# EAGLE design NRF24L01 TestbedV1 (EAGLE 6.5.0)
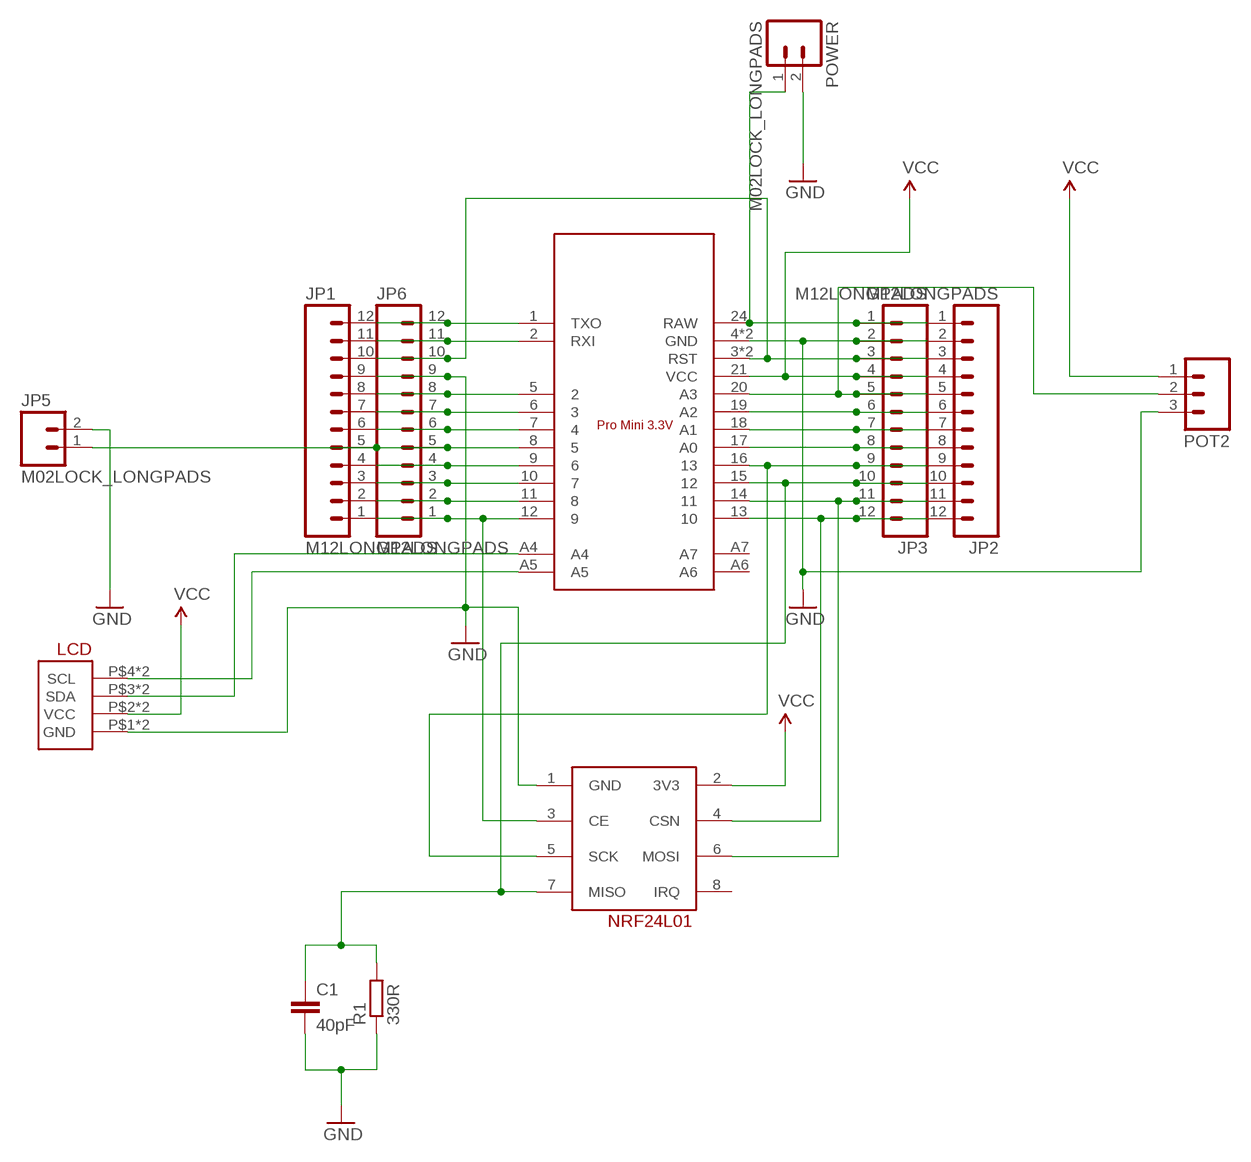
[diagram p0: schematic, sheet 1]

## Parts
C1  40pF  C-EUC1206  [C1206]
JP1  M12LONGPADS  [1X12_LONGPADS]
JP2  M12LONGPADS  [1X12_LONGPADS]
JP3  M12LONGPADS  [1X12_LONGPADS]
JP5  M02LOCK_LONGPADS  [1X02_LOCK_LONGPADS]
JP6  M12LONGPADS  [1X12_LONGPADS]
POT2  M03LONGPADS  [1X03_LONGPADS]
POWER  M02LOCK_LONGPADS  [1X02_LOCK_LONGPADS]
R1  330R  R-EU_R1206  [R1206]
U$1  ARDUINO_PRO_MINI_3V3  [ARDUINO_PRO_MINI_3V3]
U$2  NRF24L01BOARD  [NRF24L01BOARD]
U$3  I2C-LCD  [I2C-LCD]

## Nets
GND: C1.2 JP1.9 JP2.2 JP3.2 JP5.2 JP6.9 POT2.3 POWER.2 R1.1 U$1.4(GND) U$1.23(GND) U$2.1(GND) U$3.P$1(GND) U$3.S$1(GND)
N$1: JP2.5 JP3.5 POT2.2 U$1.20(A3)
N$2: JP1.12 JP6.12 U$1.1(TXO)
N$3: JP1.11 JP6.11 U$1.2(RXI)
N$4: JP1.4 JP6.4 U$1.9
N$6: JP1.8 JP6.8 U$1.5
N$7: JP1.10 JP2.3 JP3.3 JP6.10 U$1.3(RST) U$1.22(RST)
N$8: JP1.7 JP6.7 U$1.6
N$9: JP1.6 JP6.6 U$1.7
N$10: JP1.5 JP5.1 JP6.5 U$1.8
N$11: JP1.3 JP6.3 U$1.10
N$12: JP1.2 JP6.2 U$1.11
N$14: JP1.1 JP6.1 U$1.12 U$2.3(CE)
N$15: JP2.1 JP3.1 POWER.1 U$1.24(RAW)
N$17: JP2.6 JP3.6 U$1.19(A2)
N$18: JP2.7 JP3.7 U$1.18(A1)
N$19: JP2.8 JP3.8 U$1.17(A0)
N$20: JP2.9 JP3.9 U$1.16 U$2.5(SCK)
N$21: C1.1 JP2.10 JP3.10 R1.2 U$1.15 U$2.7(MISO)
N$22: JP2.11 JP3.11 U$1.14 U$2.6(MOSI)
N$23: JP2.12 JP3.12 U$1.13 U$2.4(CSN)
N$24: U$1.A4 U$3.P$3(SDA) U$3.S$3(SDA)
N$25: U$1.A5 U$3.P$4(SCL) U$3.S$4(SCL)
VCC: JP2.4 JP3.4 POT2.1 U$1.21(VCC) U$2.2(3V3) U$3.P$2(VCC) U$3.S$2(VCC)
Unconnected: U$1.A6 U$1.A7 U$2.8(IRQ)

## Library data of the parts
C1 = rcl:C-EU: CAPACITOR, European symbol
JP1-JP3 JP6 = SparkFun-Connectors:M12: Header 12 Standard 12-pin 0.1" header. Use with straight break away headers (SKU : PRT-00116), right angle break away headers (PRT-00553), swiss pins (PRT-00743), machine pins (PRT-00117), and female headers (PRT-00115).
JP5 POWER = SparkFun-Connectors:M02: Standard 2-pin 0.1" header. Use with - straight break away headers ( PRT-00116) - right angle break away headers (PRT-00553) - swiss pins (PRT-00743) - machine pins (PRT-00117) - female headers (PRT-00115) Molex polarized connector foot print use with: PRT-08233 with associated crimp pins and housings. 2.54_SCREWTERM for use with PRT-10571. 3.5mm Screw Terminal footprints for PRT-08084 5mm Screw Terminal footprints for use with PRT-08433
POT2 = SparkFun-Connectors:M03: Header 3 Standard 3-pin 0.1" header. Use with straight break away headers (SKU : PRT-00116), right angle break away headers (PRT-00553), swiss pins (PRT-00743), machine pins (PRT-00117), and female headers (PRT-00115). Molex polarized connector foot print use with SKU : PRT-08232 with associated crimp pins and housings.
R1 = rcl:R-EU_: RESISTOR, European symbol
U$1 = ASP_Library:ARDUINO_PRO_MINI_3V3
U$2 = ASP_Library:NRF24L01BOARD
U$3 = ASP_Library:I2C-LCD

## Board
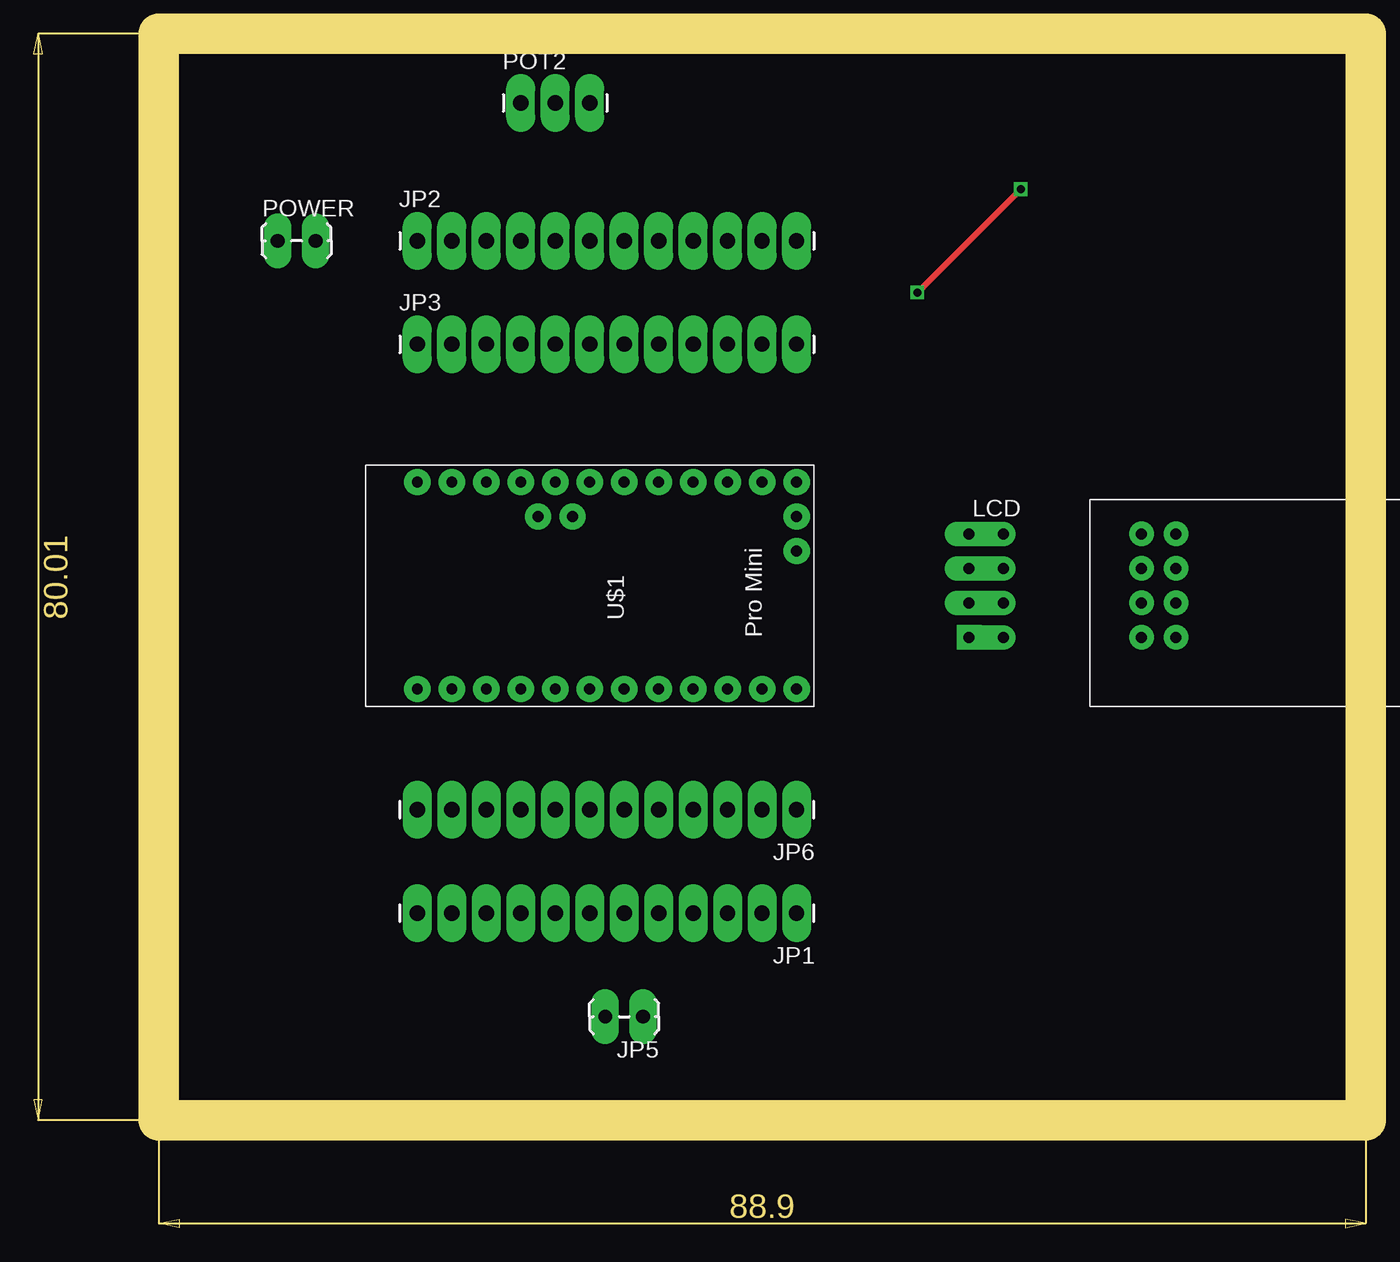
[diagram p1: board, top side]
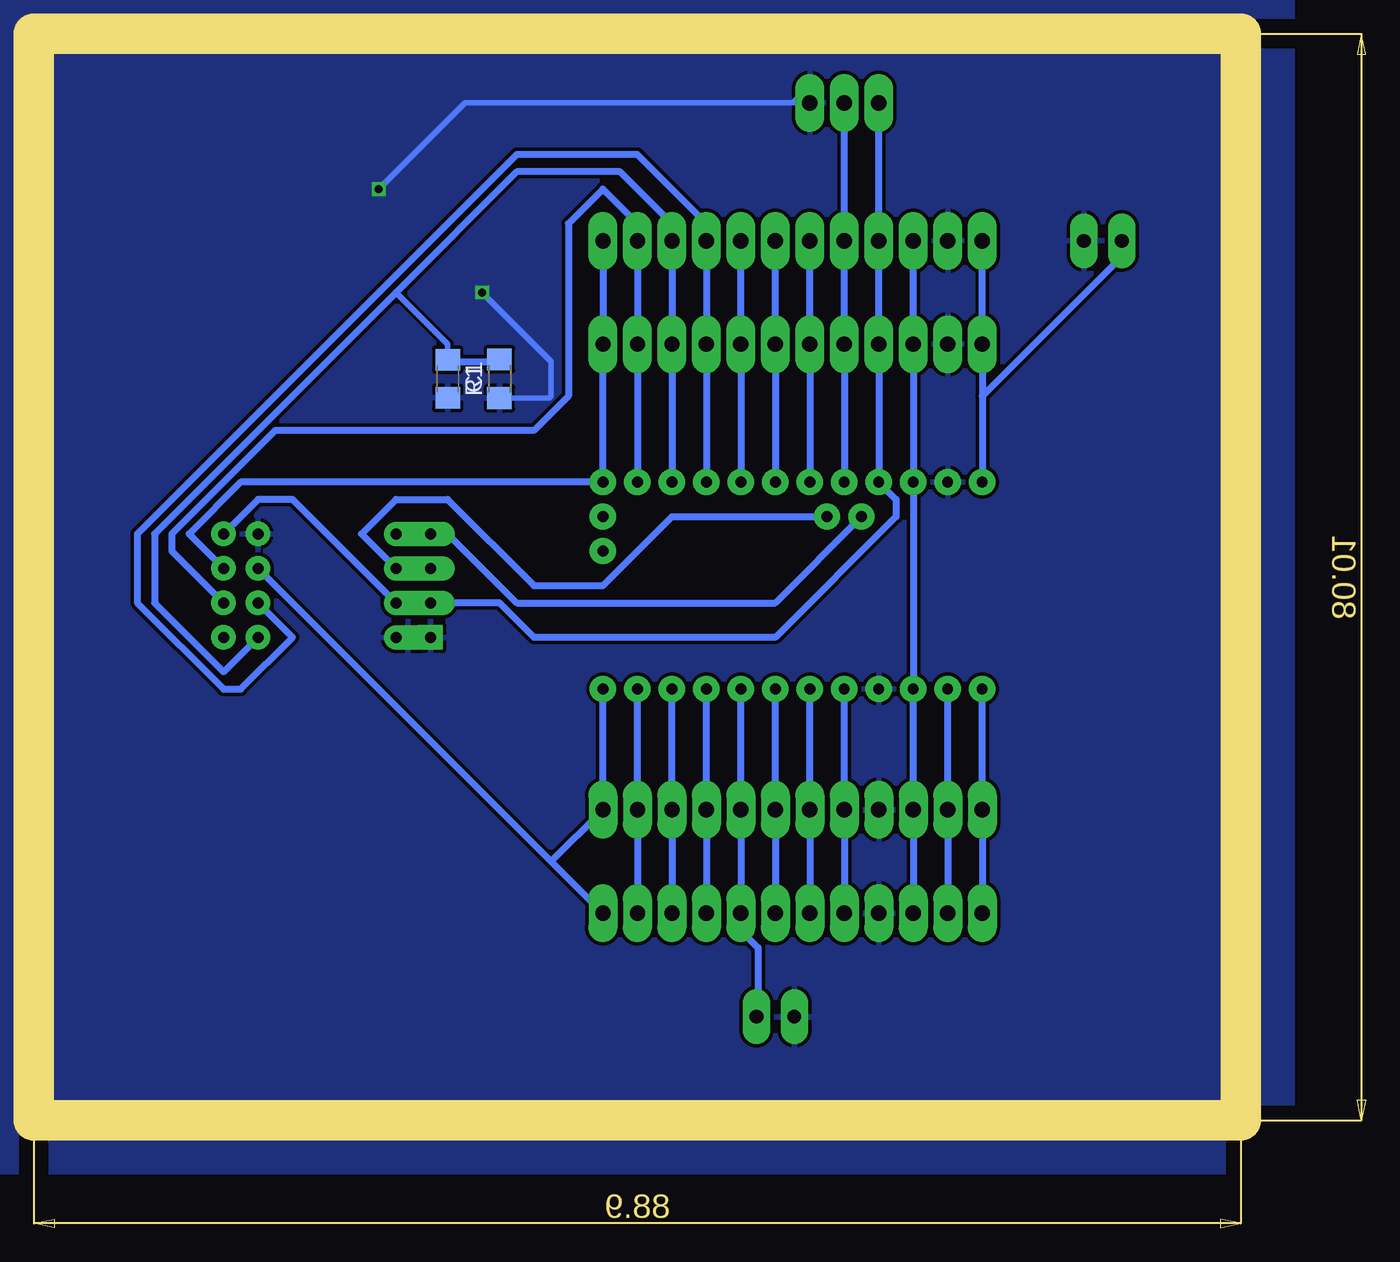
[diagram p2: board, bottom side, seen from below]

Size 98.09 x 87.93 mm. Coordinates in mm from the lower left corner, seen from the top.
Copper layers (1*16): Top 0.035mm / dielectric 1.5mm / Bottom 0.035mm
Design rules "default *": minimum track width 20mil, minimum drill 24mil, track to track 10mil, track to pad 10mil, pad to pad 8mil, via to via 8mil, smd to smd 8mil, copper to edge 40mil, drill to drill 8mil, minimum pad ring 20mil, minimum via ring 8mil, stop-mask expansion 4mil, vias tented up to drill 0mil, thermal gap 10mil
Milling: 4 lines

### Footprints (pad centres in the part's own frame; a part is rotated, then mirrored left to right if it is on the bottom)
C1206 = smd 1.6 x 1.8: 1 -1.4,0; 2 1.4,0
1X12_LONGPADS = drill 1.118 pad 1.88 long: 1 0,0; 2 2.54,0; 3 5.08,0; 4 7.62,0; 5 10.16,0; 6 12.7,0; 7 15.24,0; 8 17.78,0; 9 20.32,0; 10 22.86,0; 11 25.4,0; 12 27.94,0
1X02_LOCK_LONGPADS = drill 1.016 long: 1 -0.127,0; 2 2.667,0
1X03_LONGPADS = drill 1.118 pad 1.88 long: 1 0,0; 2 2.54,0; 3 5.08,0
R1206 = smd 1.6 x 1.803: 1 -1.422,0; 2 1.422,0
ARDUINO_PRO_MINI_3V3 = drill 0.8 pad 1.93: 1 -7.62,12.7; 2 -7.62,10.16; 3 -7.62,7.62; 4 -7.62,5.08; 5 -7.62,2.54; 6 -7.62,0; 7 -7.62,-2.54; 8 -7.62,-5.08; 9 -7.62,-7.62; 10 -7.62,-10.16; 11 -7.62,-12.7; 12 -7.62,-15.24; 13 7.62,-15.24; 14 7.62,-12.7; 15 7.62,-10.16; 16 7.62,-7.62; 17 7.62,-5.08; 18 7.62,-2.54; 19 7.62,0; 20 7.62,2.54; 21 7.62,5.08; 22 7.62,7.62; 23 7.62,10.16; 24 7.62,12.7; A4 5.08,1.27; A5 5.08,3.81; A6 5.08,-15.24; A7 2.54,-15.24
NRF24L01BOARD = drill 0.8 pad 1.778: 1 2.54,3.81; 2 2.54,6.35; 3 5.08,3.81; 4 5.08,6.35; 5 7.62,3.81; 6 7.62,6.35; 7 10.16,3.81; 8 10.16,6.35
I2C-LCD = drill 0.8 square: P$1 0,3.81 | drill 0.8 long: P$2 0,1.27; P$3 0,-1.27; P$4 0,-3.81 | drill 0.8 offset: S$1 -2.54,3.81; S$2 -2.54,1.27; S$3 -2.54,-1.27; S$4 -2.54,-3.81

### Placement (x,y rotation side)
C1  67.61,62.53 270 bottom
JP1  56.18,23.16 180 top
JP2  28.24,72.69 0 top
JP3  28.24,65.07 0 top
JP5  44.75,15.54 180 top
JP6  56.18,30.78 180 top
POT2  35.86,82.85 0 top
POWER  18.08,72.69 0 top
R1  63.8,62.53 90 bottom
U$1  40.94,47.29 90 top
U$2  77.77,53.64 270 top
U$3  68.88,47.29 180 top

### Tracks (layer width: path | path; a pad name or v marks a point on that pad's centre or on a via)
GND  (via drill 0.6)
  Top 0.406: v65.07,68.88 v72.69,76.5
  Bottom 0.406: R1.1 60.14,61.11 59.99,61.26 59.99,63.8 v65.07,68.88 | v72.69,76.5 66.34,82.85 42.21,82.85 | 40.94,84.12 42.21,82.85 | 42.21,82.85 POT2.3
  pour Bottom: 5.38,4.11 5.38,93.01 104.44,93.01 104.44,4.11
N$1
  Bottom 0.508: U$1.20 JP3.5 JP2.5 POT2.2
N$2
  Bottom 0.508: U$1.1 JP6.12 JP1.12
N$3
  Bottom 0.508: U$1.2 JP6.11 JP1.11
N$4
  Bottom 0.508: U$1.9 JP6.4 JP1.4
N$6
  Bottom 0.508: U$1.5 JP6.8 JP1.8
N$7
  Bottom 0.508: JP1.10 JP6.10 U$1.3 U$1.22 JP3.3 JP2.3
N$8
  Bottom 0.508: U$1.6 JP6.7 JP1.7
N$9
  Bottom 0.508: U$1.7 JP6.6 JP1.6
N$10
  Bottom 0.508: JP5.1 44.75,15.54 44.75,20.62 46.02,21.89 JP1.5 JP6.5 U$1.8
N$11
  Bottom 0.508: U$1.10 JP6.3 JP1.3
N$12
  Bottom 0.508: U$1.11 JP6.2 JP1.2
N$14
  Bottom 0.508: U$1.12 JP6.1 59.99,26.97 | JP1.1 59.99,26.97 | 59.99,26.97 U$2.3
N$15
  Bottom 0.508: 28.24,61.26 JP3.1 JP2.1 | 28.24,61.26 U$1.24 | 28.24,61.26 18.08,71.42 18.08,72.69 POWER.1
N$17
  Bottom 0.508: U$1.19 JP3.6 JP2.6
N$18
  Bottom 0.508: U$1.18 JP3.7 JP2.7
N$19
  Bottom 0.508: U$1.17 JP3.8 JP2.8
N$20
  Bottom 0.508: U$1.16 JP3.9 JP2.9 48.56,73.96 53.64,79.04 62.53,79.04 90.47,51.1 90.47,46.02 84.12,39.67 82.85,39.67 79.04,43.48 U$2.5
N$21
  Bottom 0.406: C1.1 67.61,65.07 71.42,68.88
  Bottom 0.508: U$1.15 JP3.10 JP2.10 51.1,73.96 54.91,77.77 62.53,77.77 71.42,68.88 89.2,51.1 89.2,46.02 84.12,40.94 U$2.7 | R1.2 63.8,63.8 67.61,63.8 C1.1
N$22
  Bottom 0.508: U$1.14 JP3.11 JP2.11 53.64,73.96 56.18,76.5 58.72,73.96 58.72,61.26 61.26,58.72 80.31,58.72 87.93,51.1 87.93,49.83 U$2.6
N$23
  Bottom 0.508: JP2.12 JP3.12 U$1.13 82.85,54.91 86.66,51.1 U$2.4
N$24
  Bottom 0.508: U$3.P$3 U$3.S$3 73.96,51.1 71.42,53.64 67.61,53.64 61.26,47.29 56.18,47.29 51.1,52.37 U$1.A4
N$25
  Bottom 0.508: U$3.S$4 U$3.P$4 67.61,51.1 62.53,46.02 43.48,46.02 U$1.A5
VCC
  Bottom 0.508: U$2.2 81.58,53.64 79.04,53.64 U$3.S$2 U$3.P$2 63.8,46.02 61.26,43.48 43.48,43.48 34.59,52.37 34.59,53.64 U$1.21 JP3.4 JP2.4 POT2.1